# EAGLE design PCB_Mega (EAGLE 9.6.2)
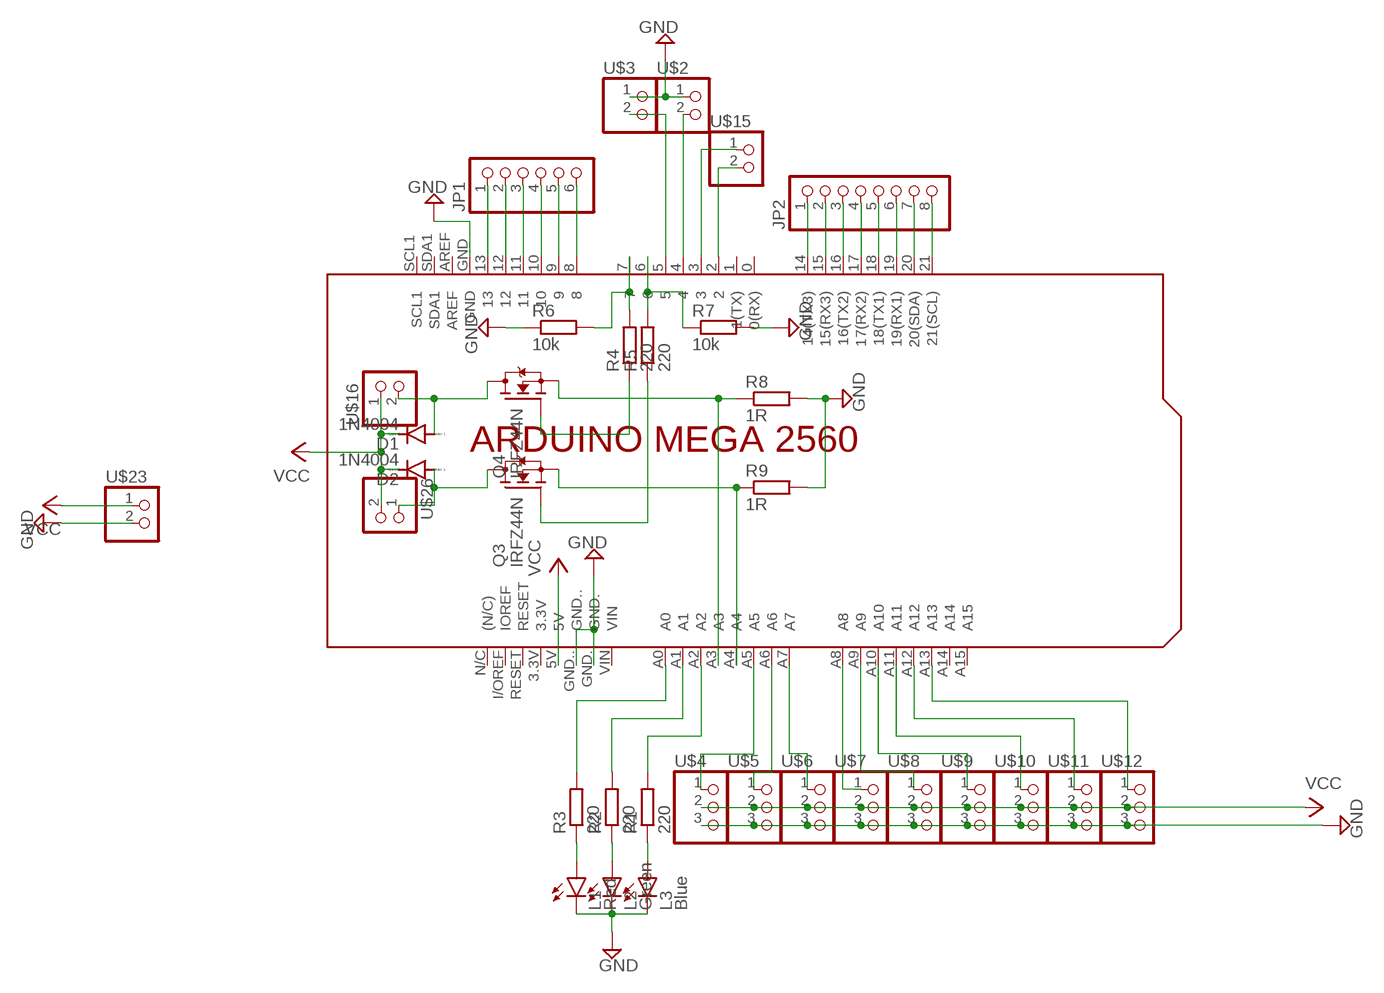
[diagram p0: schematic, sheet 1]

## Parts
D1  1N4004  [DO41-10]
D2  1N4004  [DO41-10]
JP1  PINHD-1X6  [1X06]
JP2  PINHD-1X8  [1X08]
L1  Red  LED3MM  [LED3MM]
L2  Green  LED3MM  [LED3MM]
L3  Blue  LED3MM  [LED3MM]
Q3  IRFZ44N  [TO220V]
Q4  IRFZ44N  [TO220V]
R1  220  RESISTOR_1/4WOFFSET  [0207/7-OFFSET]
R2  220  RESISTOR_1/4WOFFSET  [0207/7-OFFSET]
R3  220  RESISTOR_1/4WOFFSET  [0207/7-OFFSET]
R4  220  RESISTOR_1/4WOFFSET  [0207/7-OFFSET]
R5  220  RESISTOR_1/4WOFFSET  [0207/7-OFFSET]
R6  10k  RESISTOR_1/4WOFFSET  [0207/7-OFFSET]
R7  10k  RESISTOR_1/4WOFFSET  [0207/7-OFFSET]
R8  1R  RESISTOR_5W90PAD  [10/28-90]
R9  1R  RESISTOR_5W90PAD  [10/28-90]
U$1  ARDUINO_MEGA2560_SHIELD_NO_LOWER  [ARDUINO_MEGA2560_SHIELD_NO_LOWER]
U$2  PINHD-1X2  [1X02]
U$3  PINHD-1X2  [1X02]
U$4  PINHD-1X3  [1X03]
U$5  PINHD-1X3  [1X03]
U$6  PINHD-1X3  [1X03]
U$7  PINHD-1X3  [1X03]
U$8  PINHD-1X3  [1X03]
U$9  PINHD-1X3  [1X03]
U$10  PINHD-1X3  [1X03]
U$11  PINHD-1X3  [1X03]
U$12  PINHD-1X3  [1X03]
U$15  PINHD-1X2  [1X02]
U$16  TERMINALBLOCK_1X2-5.0MM  [TERMINALBLOCK_1X2-5.0MM]
U$23  TERMINALBLOCK_1X2-5.0MM  [TERMINALBLOCK_1X2-5.0MM]
U$26  TERMINALBLOCK_1X2-5.0MM  [TERMINALBLOCK_1X2-5.0MM]

## Nets
GND: L1.K(C) L2.K(C) L3.K(C) R6.1 R7.2 R8.P$2 R9.P$2 U$1.GND U$1.GND. U$1.GND.. U$2.1 U$3.1 U$4.3 U$5.3 U$6.3 U$7.3 U$8.3 U$9.3 U$10.3 U$11.3 U$12.3 U$23.2
N$1: U$1.A5 U$4.1
N$2: U$1.A6 U$5.1
N$3: U$1.A7 U$6.1
N$4: U$1.A8 U$7.1
N$5: U$1.A9 U$8.1
N$6: U$1.A10 U$9.1
N$7: U$1.A11 U$10.1
N$8: U$1.A12 U$11.1
N$9: U$1.A13 U$12.1
N$10: JP1.1 U$1.13
N$11: JP1.2 U$1.12
N$12: JP1.3 U$1.11
N$13: JP1.4 U$1.10
N$14: JP1.5 U$1.9
N$15: U$1.5 U$3.2
N$16: U$1.4 U$2.2
N$17: JP2.1 U$1.14(14(TX3))
N$18: JP2.2 U$1.15(15(RX3))
N$19: U$1.3 U$15.1
N$20: U$1.2 U$15.2
N$21: JP1.6 U$1.8
N$22: JP2.3 U$1.16(16(TX2))
N$23: JP2.4 U$1.17(17(RX2))
N$24: JP2.5 U$1.18(18(TX1))
N$25: D1.A Q4.2(D) U$16.2
N$26: R4.2 R6.2 U$1.7
N$27: R5.2 R7.1 U$1.6
N$28: D2.A Q3.2(D) U$26.1
N$29: JP2.6 U$1.19(19(RX1))
N$30: JP2.7 U$1.20(20(SDA))
N$31: JP2.8 U$1.21(21(SCL))
N$32: Q3.1(G) R5.1
N$33: Q4.1(G) R4.1
N$34: L1.A R3.1
N$35: L2.A R2.1
N$36: L3.A R1.1
N$37: R1.2 U$1.A2
N$38: R2.2 U$1.A1
N$39: R3.2 U$1.A0
N$46: Q3.3(S) R9.P$1 U$1.A4
N$52: Q4.3(S) R8.P$1 U$1.A3
VCC: D1.C D2.C U$1.5V U$4.2 U$5.2 U$6.2 U$7.2 U$8.2 U$9.2 U$10.2 U$11.2 U$12.2 U$16.1 U$23.1 U$26.2
Unconnected: U$1.0(0(RX)) U$1.1(1(TX)) U$1.3.3V U$1.A14 U$1.A15 U$1.AREF U$1.I/OREF(IOREF) U$1.N/C((N/C)) U$1.RESET U$1.SCL1 U$1.SDA1 U$1.VIN

## Library data of the parts
D1 D2 = diode:1N4004: DIODE general purpose rectifier, 1 A
JP1 = pinhead:PINHD-1X6: PIN HEADER
JP2 = pinhead:PINHD-1X8: PIN HEADER
L1-L3 = Basics:LED3MM
Q3 Q4 = IRFZ44N:IRFZ44N: N-CHANNEL HEXFET POWER-MOS-FET; AVAILABILITY: Unavailable; DESCRIPTION: Trans MOSFET N-CH 55V 49A 3-Pin TO-220AB; MP: IRFZ44N; PACKAGE: TO-220 Intersil; PRICE: None
R1-R7 = Basics:RESISTOR_1/4W: AXIAL RESISTOR type 0207 8.76 mm pitch, 6.50 mm body lengh, 2.50 mm body diameter, 25 mil (0.64mm) lead diameter
R8 R9 = Basics:RESISTOR_5W: CEMENT RESISTOR body 10x10x22mm, grid 28 mm
U$1 = Arduino_Shield:ARDUINO_MEGA2560_SHIELD_NO_LOWER: Base shield for Arduino Mega2560 board without the lower header.
U$2 U$3 U$15 = pinhead:PINHD-1X2: PIN HEADER
U$4-U$12 = pinhead:PINHD-1X3: PIN HEADER
U$16 U$23 U$26 = TerminalBlock:TERMINALBLOCK_1X2-5.0MM: 1x2-5.0MM TERMINAL BLOCK Simple screw terminal. 2 pins with 5.0mm pitch; PITCH: 5mm

## Board
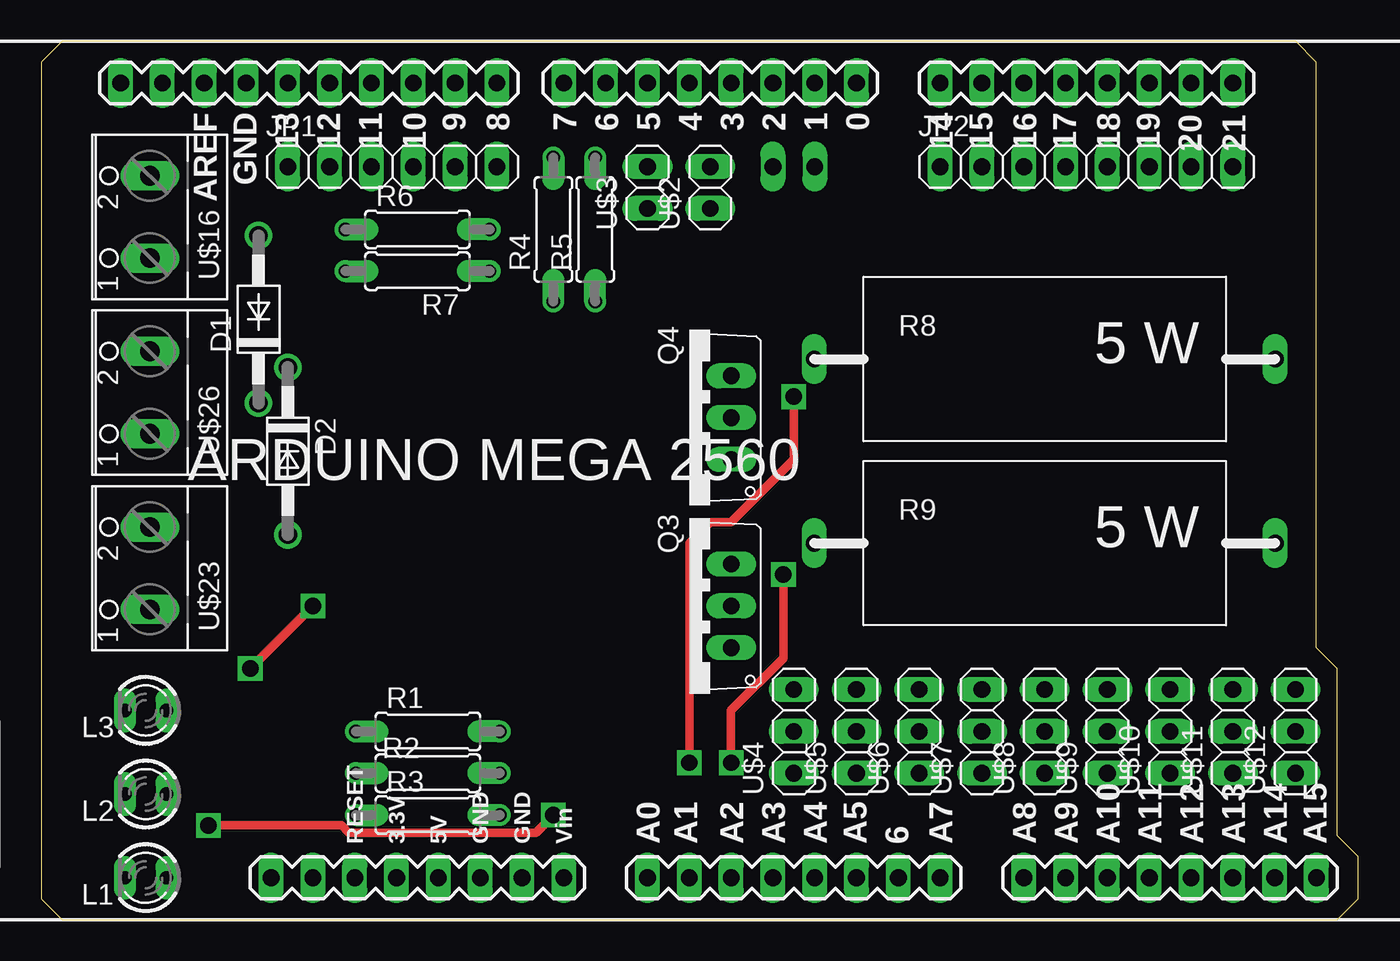
[diagram p1: board, top side]
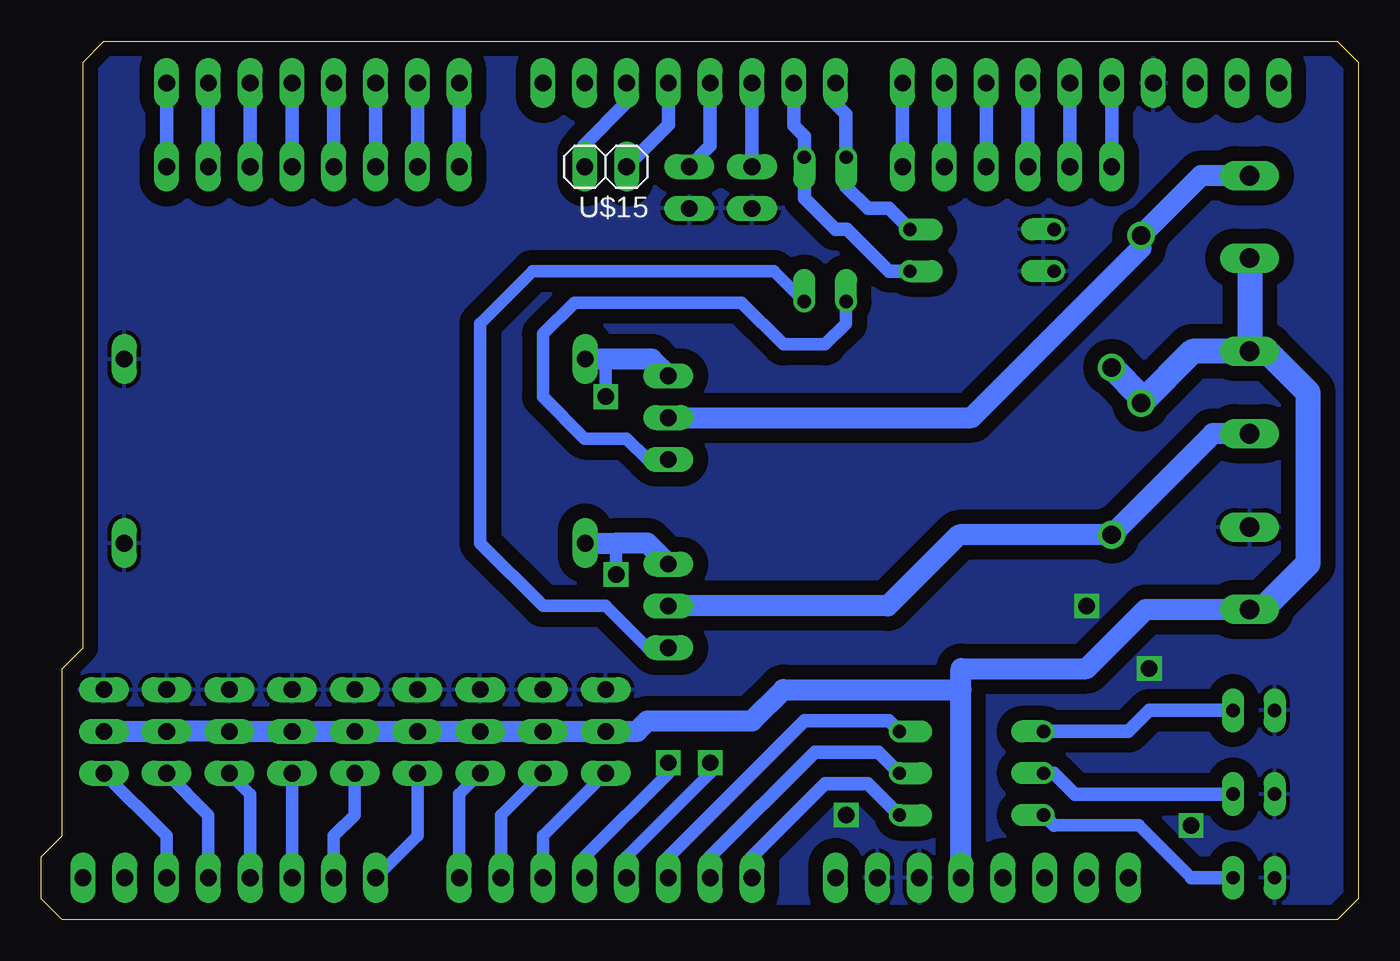
[diagram p2: board, bottom side, seen from below]

Size 80.01 x 53.34 mm. Coordinates in mm from the lower left corner, seen from the top.
Outline: 1.27,0 78.74,0 80.01,1.27 80.01,3.81 78.74,5.08 78.74,15.24 77.47,16.51 77.47,52.07 76.2,53.34 1.27,53.34 0,52.07 0,1.27 1.27,0
Copper layers (1*16): Top 0.035mm / dielectric 1.5mm / Bottom 0.035mm
Design rules "default *": minimum track width 6mil, minimum drill 0.35mm, track to track 6mil, track to pad 6mil, pad to pad 6mil, via to via 6mil, smd to smd 6mil, copper to edge 20mil, drill to drill 6mil, minimum pad ring 10mil, minimum via ring 8mil, stop-mask expansion 4mil, vias tented up to drill 0mil, thermal gap 10mil

### Footprints (pad centres in the part's own frame; a part is rotated, then mirrored left to right if it is on the bottom)
DO41-10 = drill 1.118: A 5.08,0; C -5.08,0
1X06 = drill 1.016 long: 1 -6.35,0; 2 -3.81,0; 3 -1.27,0; 4 1.27,0; 5 3.81,0; 6 6.35,0
1X08 = drill 1.016 long: 1 -8.89,0; 2 -6.35,0; 3 -3.81,0; 4 -1.27,0; 5 1.27,0; 6 3.81,0; 7 6.35,0; 8 8.89,0
LED3MM = drill 0.813 long: A -1.27,0; K 1.27,0
TO220V = drill 1.016 long: 1 -2.54,-2.54; 2 0,-2.54; 3 2.54,-2.54
0207/7-OFFSET = drill 0.813 offset: 1 -4.38,0; 2 4.38,0
10/28-90 = drill 1.016 long: P$1 -14,0; P$2 14,0
ARDUINO_MEGA2560_SHIELD_NO_LOWER = drill 1.016 long: 0 63.5,50.8; 1 60.96,50.8; 2 58.42,50.8; 3 55.88,50.8; 3.3V 35.56,2.54; 4 53.34,50.8; 5 50.8,50.8; 5V 38.1,2.54; 6 48.26,50.8; 7 45.72,50.8; 8 41.656,50.8; 9 39.116,50.8; 10 36.576,50.8; 11 34.036,50.8; 12 31.496,50.8; 13 28.956,50.8; 14 68.58,50.8; 15 71.12,50.8; 16 73.66,50.8; 17 76.2,50.8; 18 78.74,50.8; 19 81.28,50.8; 20 83.82,50.8; 21 86.36,50.8; A0 50.8,2.54; A1 53.34,2.54; A2 55.88,2.54; A3 58.42,2.54; A4 60.96,2.54; A5 63.5,2.54; A6 66.04,2.54; A7 68.58,2.54; A8 73.66,2.54; A9 76.2,2.54; A10 78.74,2.54; A11 81.28,2.54; A12 83.82,2.54; A13 86.36,2.54; A14 88.9,2.54; A15 91.44,2.54; AREF 23.876,50.8; GND 26.416,50.8; GND. 43.18,2.54; GND.. 40.64,2.54; I/OREF 30.48,2.54; N/C 27.94,2.54; RESET 33.02,2.54; SCL1 18.796,50.8; SDA1 21.336,50.8; VIN 45.72,2.54
1X02 = drill 1.016 long: 1 -1.27,0; 2 1.27,0
1X03 = drill 1.016 long: 1 -2.54,0; 2 0,0; 3 2.54,0
TERMINALBLOCK_1X2-5.0MM = drill 1.2 long: 1 -2.5,0; 2 2.5,0

### Placement (x,y rotation side)
D1  13.21,36.45 90 top
D2  14.99,28.45 270 top
JP1  21.34,45.72 0 top
JP2  63.5,45.72 0 top
L1  6.35,2.54 180 top
L2  6.35,7.62 180 top
L3  6.35,12.7 180 top
Q3  39.37,19.05 90 top
Q4  39.37,30.48 90 top
R1  23.5,11.43 0 top
R2  23.5,8.89 0 top
R3  23.5,6.35 0 top
R4  31.11,41.91 90 top
R5  33.66,41.91 90 top
R6  22.86,41.91 0 top
R7  22.86,39.37 180 top
R8  60.96,34.04 0 top
R9  60.96,22.86 0 top
U$1  -13.97,0 0 top
U$2  40.64,44.45 90 top
U$3  36.83,44.45 90 top
U$4  45.72,11.43 90 top
U$5  49.53,11.43 90 top
U$6  53.34,11.43 90 top
U$7  57.15,11.43 90 top
U$8  60.96,11.43 90 top
U$9  64.77,11.43 90 top
U$10  68.58,11.43 90 top
U$11  72.39,11.43 90 top
U$12  76.2,11.43 90 top
U$15  45.72,45.72 180 bottom
U$16  6.6,42.67 90 top
U$23  6.6,21.34 90 top
U$26  6.6,32 90 top

### Tracks (layer width: path | path; a pad name or v marks a point on that pad's centre or on a via)
GND  (via drill 1)
  Top 0.508: v10.16,5.72 18.24,5.72 18.67,5.28 30.05,5.28 v31.11,6.35 | v12.7,15.24 v16.51,19.05
  pour Bottom (isolate 0.889): 0,53.34 0,0 80.01,0 80.01,53.34
  pour Bottom: 60.32,42.55 69.85,42.55 69.85,15.88 60.32,15.88
N$1
  Bottom 0.762: U$1.A5 49.53,5.08 U$4.1
N$2
  Bottom 0.762: U$1.A6 52.07,6.35 U$5.1
N$3
  Bottom 0.762: U$6.1 54.61,7.62 U$1.A7
N$4
  Bottom 0.762: U$1.A8 57.15,5.08 U$7.1
N$5
  Bottom 0.762: U$8.1 60.96,6.35 62.23,5.08 U$1.A9
N$6
  Bottom 0.762: U$1.A10 U$9.1
N$7
  Bottom 0.762: U$1.A11 67.31,7.62 U$10.1
N$8
  Bottom 0.762: U$1.A12 69.85,6.35 U$11.1
N$9
  Bottom 0.762: U$1.A13 72.39,5.08 U$12.1
N$10
  Bottom 0.813: U$1.13 JP1.1
N$11
  Bottom 0.813: JP1.2 U$1.12
N$12
  Bottom 0.813: U$1.11 JP1.3
N$13
  Bottom 0.813: JP1.4 U$1.10
N$14
  Bottom 0.813: U$1.9 JP1.5
N$15
  Bottom 0.813: U$1.5 U$3.2
N$16
  Bottom 0.813: U$1.4 39.37,46.99 U$2.2
N$17
  Bottom 0.813: U$1.14 JP2.1
N$18
  Bottom 0.813: JP2.2 U$1.15
N$19
  Bottom 0.813: U$1.3 41.91,48.26 U$15.1
N$20
  Bottom 0.813: U$15.2 47.04,45.77 47.04,47.03 44.45,49.62 U$1.2
N$21
  Bottom 0.813: JP1.6 U$1.8
N$22
  Bottom 0.813: U$1.16 JP2.3
N$23
  Bottom 0.813: JP2.4 U$1.17
N$24
  Bottom 0.813: U$1.18 JP2.5
N$25
  Bottom 1.27: U$16.2 9.56,45.17 D1.A 13.21,40.77 23.5,30.48 Q4.2
N$26
  Bottom 0.813: U$1.7 31.75,49.53 31.11,48.9 R4.2 31.11,44.52 29.78,43.18 28.51,43.18 R6.2
N$27
  Bottom 0.813: U$1.6 34.29,48.2 33.66,47.56 R5.2 33.66,43.81 31.75,41.91 31.05,41.91 28.51,39.37 R7.1
N$28
  Bottom 1.27: U$26.1 8.85,29.5 D2.A 24.26,23.37 28.57,19.05 Q3.2
N$29
  Bottom 0.813: JP2.6 U$1.19
N$30
  Bottom 0.813: U$1.20 JP2.7
N$31
  Bottom 0.813: JP2.8 U$1.21
N$32
  Bottom 0.762: R5.1 35.5,39.37 50.16,39.37 53.34,36.2 53.34,22.86 49.53,19.05 45.72,19.05 43.18,16.51 Q3.1
N$33
  Bottom 0.762: R4.1 31.11,36.2 32.39,34.93 34.92,34.93 37.47,37.47 47.62,37.47 49.53,35.56 49.53,31.75 46.99,29.21 44.45,29.21 43.18,27.94 Q4.1
N$34
  Bottom 0.762: 10.16,2.54 13.33,5.72 18.48,5.72
  Bottom 0.813: R3.1 18.48,5.72 | L1.A 10.16,2.54
N$35
  Bottom 0.813: R2.1 18.48,8.89 17.21,7.62 L2.A
N$36
  Bottom 0.813: L3.A 12.7,12.7 13.97,11.43 R1.1
N$37
  Bottom 0.813: R1.2 28.51,12.07 33.66,12.07 41.91,3.81 U$1.A2
N$38
  Bottom 0.813: R2.2 29.14,10.16 33.02,10.16 39.37,3.81 U$1.A1
N$39
  Bottom 0.813: R3.2 29.78,8.25 32.39,8.25 36.83,3.81 U$1.A0
N$46  (via drill 1)
  Top 0.508: v45.08,20.96 45.08,15.88 41.91,12.7 v41.91,9.52
  Bottom 0.762: 45.08,22.86 v45.08,20.96 | U$1.A4 46.99,3.81 41.91,8.89 v41.91,9.52
  Bottom 1.27: Q3.3 43.18,22.86 45.08,22.86 R9.P$1
N$52  (via drill 1)
  Top 0.508: v45.72,31.75 45.72,27.94 41.91,24.13 40.64,24.13 39.37,22.86 v39.37,9.52
  Bottom 0.762: 45.72,34.04 v45.72,31.75 | U$1.A3 44.45,3.81 39.37,8.89 v39.37,9.52
  Bottom 1.27: Q4.3 42.93,34.04 45.72,34.04 R8.P$1
VCC
  Bottom 1.27: U$12.2 U$11.2 U$10.2 U$9.2 U$8.2 U$7.2 U$6.2 U$5.2 U$4.2 43.81,11.43 43.18,12.07 36.83,12.07 34.92,13.97 24.13,13.97 | U$23.1 12.91,18.84 16.51,15.24 24.13,15.24 24.13,13.97 | U$1.5V 24.13,13.97
  Bottom 1.524: U$16.1 U$26.2 | U$23.1 5.84,18.84 3.05,21.63 3.05,32 5.55,34.5 U$26.2 | U$26.2 10.07,34.5 D1.C 13.21,31.75 D2.C

### Text on the board
bRestrict: BatPierrick / - Robotik 2022